# EasyEDA Pro project 1_J_LINK_PCB.epro

# Schematic Schematic1
Board Name: Board1; Create Date: 2025-04-07; Page Name: P1; Project Name: J Link; Schematic Name: Schematic1; Update Date: 2025-04-10; Company: 嘉立创EDA; Drawed: 李晓伟; Page Size: A4; Version: V1.0
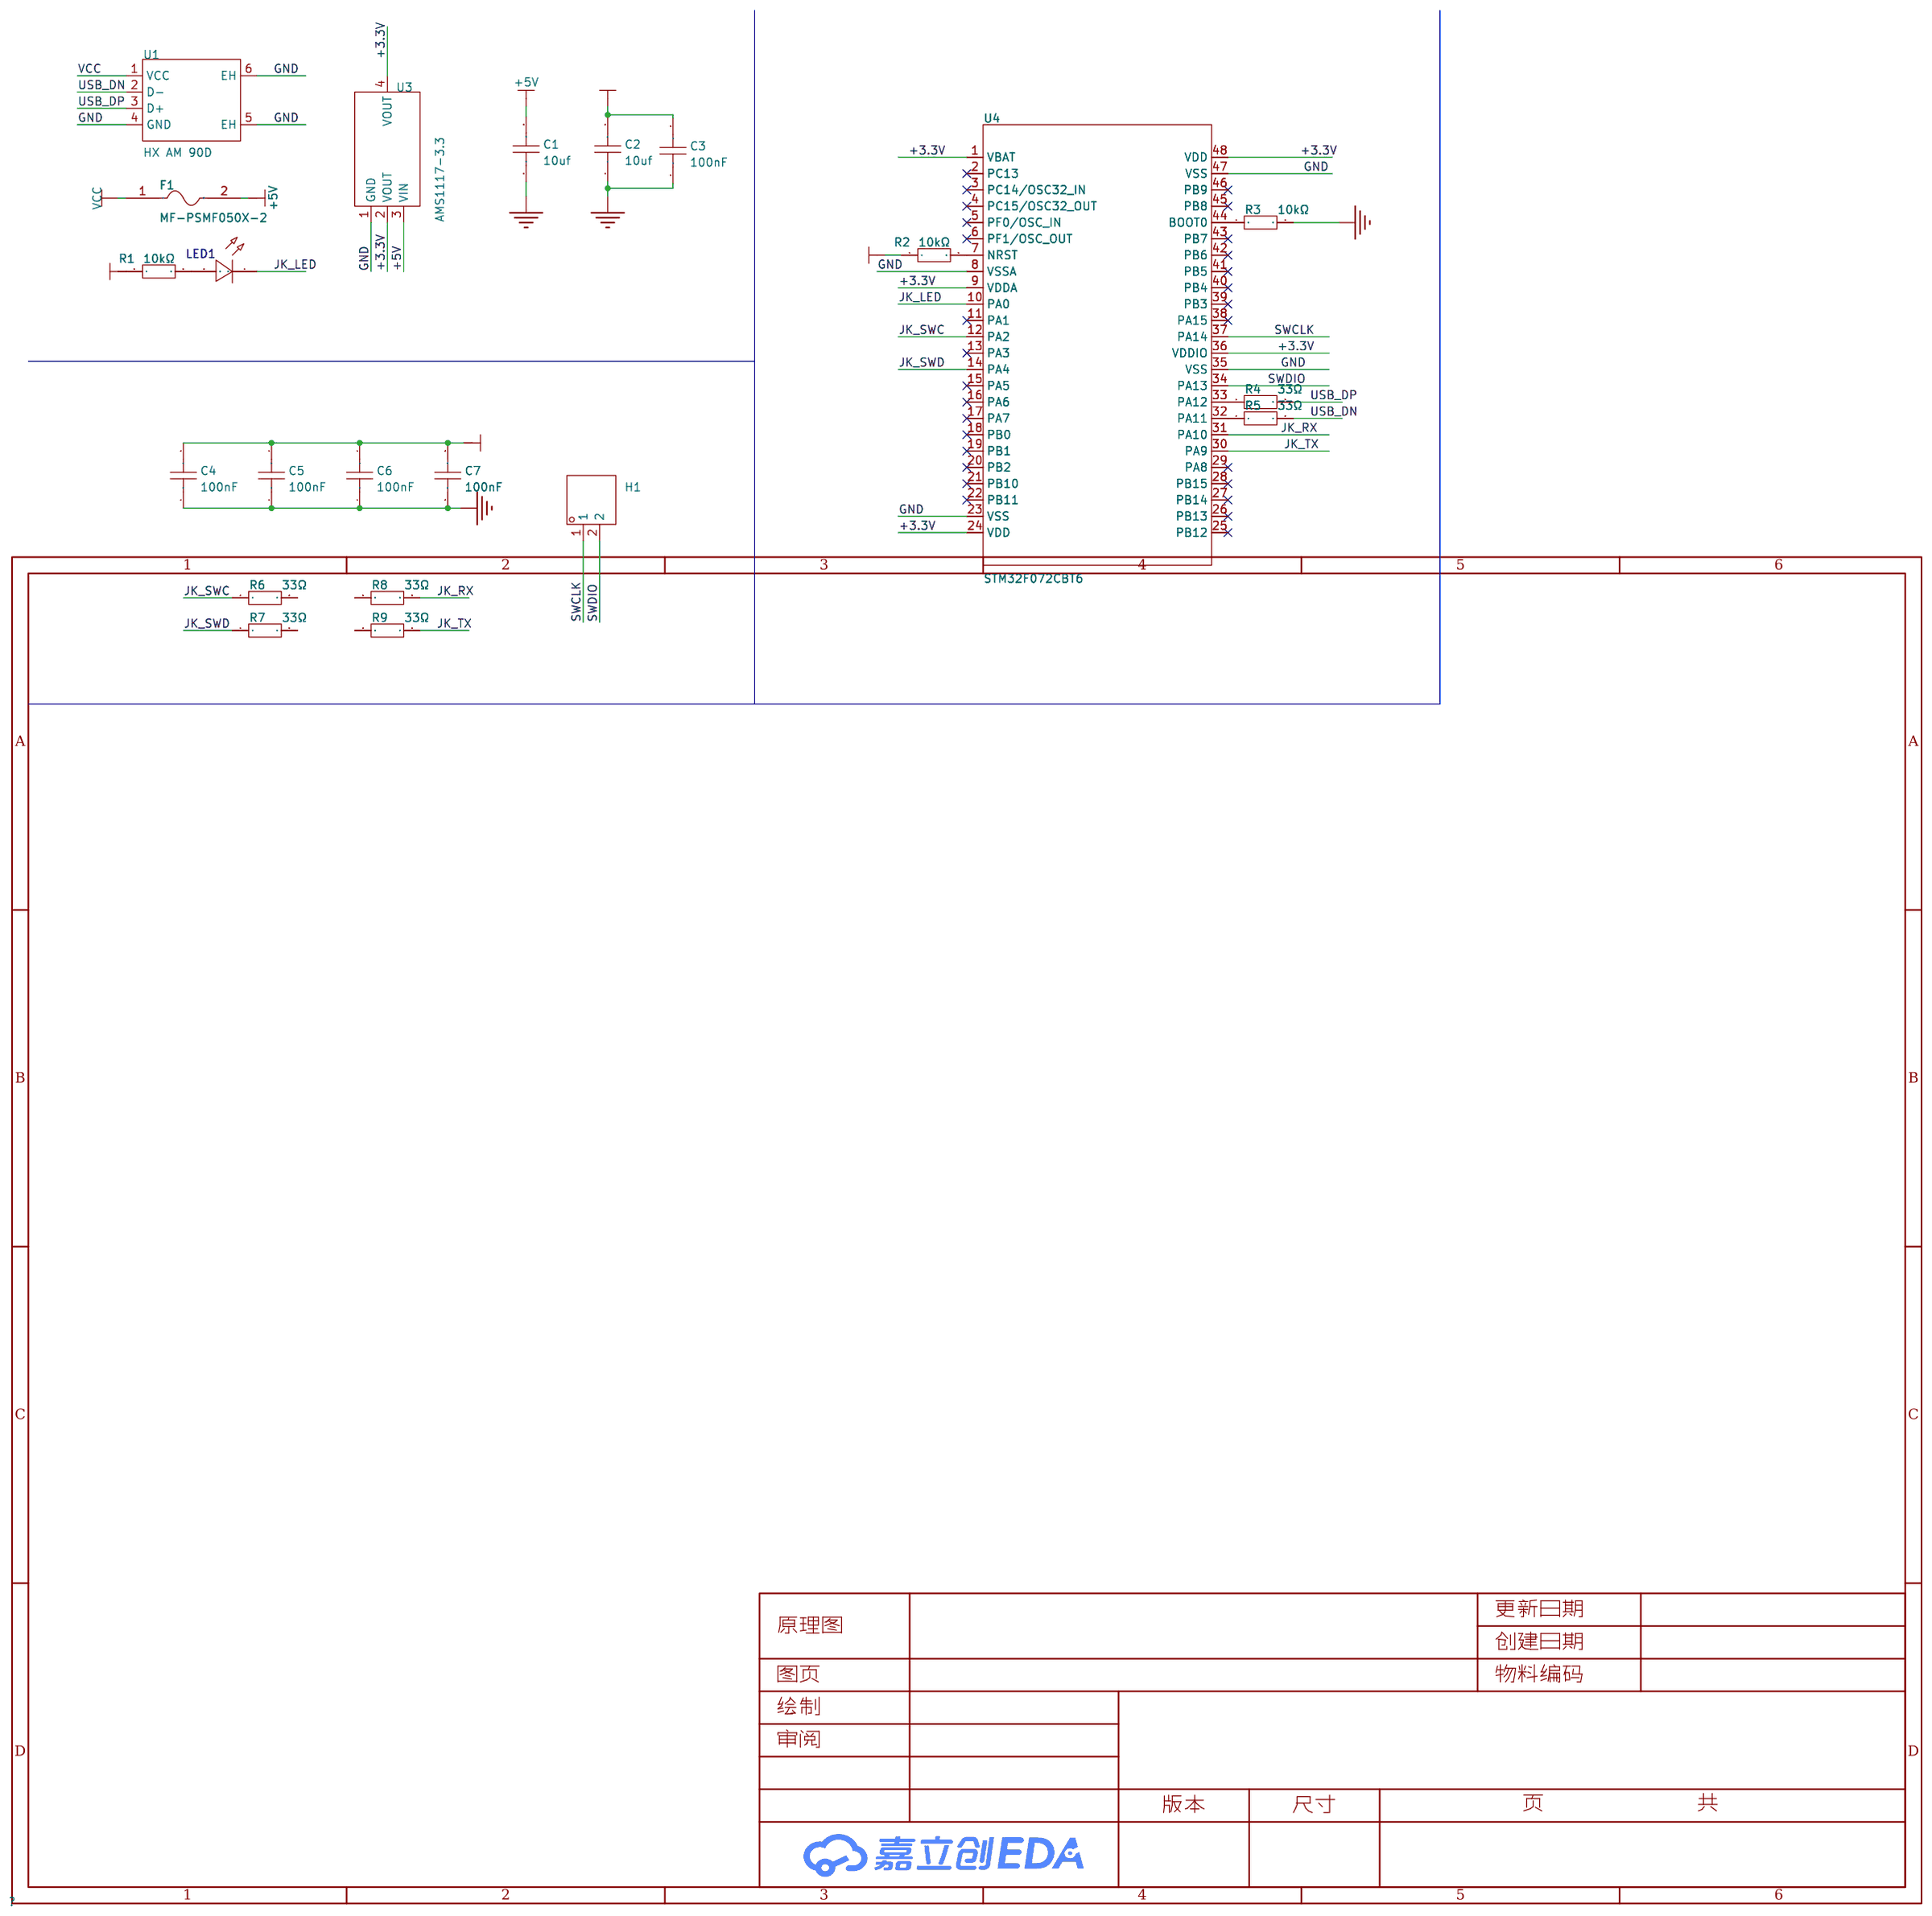
[diagram p0: schematic sheet]

## Parts
C1  10uf  [C0603]
C2  10uf  [C0603]
C3  100nF  [C0603]
C4  100nF  [C0603]
C5  100nF  [C0603]
C6  100nF  [C0603]
C7  100nF  [C0603]
F1  MF-PSMF050X-2  [F0805]
H1  -  [HDR-TH_2P-P2.54-V-M-1]
LED1  -  [LED_0603]
R1  10kΩ  [R0603]
R2  10kΩ  [R0603]
R3  10kΩ  [R0603]
R4  33Ω  [R0603]
R5  33Ω  [R0603]
R6  33Ω  [R0603]
R7  33Ω  [R0603]
R8  33Ω  [R0603]
R9  33Ω  [R0603]
U1  HX AM 90D  [USB-A-TH_HANXIA_HXAM90D]
U3  AMS1117-3.3  [SOT-223-3_L6.5-W3.4-P2.30-LS7.0-BR]
U4  STM32F072CBT6  [LQFP-48_L7.0-W7.0-P0.50-LS9.0-BL]

## Library data of the parts
C1-C3 = CAP_0603: Supplier Footprint: 0603
C4-C7 = CGA0603X7R104K500JT: 容值:100nF;精度:±10%;额定电压:50V;温度系数:X7R;; LCSC Part Name: 100nF ±10% 50V; Supplier Part: C6119867; Manufacturer: HRE(芯声); Supplier Footprint: 0603; JLCPCB Part Class: Extended Part; Datasheet: https://atta.szlcsc.com/upload/public/pdf/source/20250103/C44077DA9E7B3EFAE02F22B6D3D1CBC9.pdf; Supplier: LCSC; Tolerance: ±10%; Voltage Rating: 50V; Temperature Coefficient: X7R
F1 = MF-PSMF050X-2: 最大电压:6V;最大电流:40A;保持电流:500mA;跳闸电流:1A;; LCSC Part Name: 6V 500mA 0805自恢复; Supplier Part: C116170; Manufacturer: BOURNS; Supplier Footprint: 0805; JLCPCB Part Class: 扩展库; Datasheet: https://atta.szlcsc.com/upload/public/pdf/source/20170704/1499151353027.pdf; Supplier: LCSC; Operating Voltage (Max): 6V; Current Rating (Max): 40A; Hold Current: 500mA; Trip Current: 1A; Resistance - Initial (Ri) (Min): 150mΩ; Resistance - Post Trip (R1) (Max): 900mΩ; Maximum Time to Trip: 100ms; Operating Temperature: -40℃~+85℃
H1 = HDR-M_2.54_1x2P: Supplier Part: C124375; Supplier Footprint: 插件
LED1 = LED_0603-B: Supplier Footprint: 0603
R1-R9 = 0603WAF1002T5E: 电阻类型:厚膜电阻;阻值:10kΩ;精度:±1%;功率:100mW;最大工作电压:75V;温度系数:±100ppm/℃;; LCSC Part Name: 厚膜电阻 10kΩ ±1% 100mW; Supplier Part: C25804; Manufacturer: UNI-ROYAL(厚声); Supplier Footprint: 0603; JLCPCB Part Class: 基础库; Datasheet: https://atta.szlcsc.com/upload/public/pdf/source/20200306/C422600_1E6D84923E4A46A82E41ADD87F860B5C.pdf; Supplier: LCSC; Type: 厚膜电阻; Tolerance: ±1%; Power(Watts): 100mW; Overload Voltage (Max): 75V; Temperature Coefficient: ±100ppm/℃; Operating Temperature Range: -55℃~+155℃
U1 = HX AM 90D: 连接器类型:Type-A;标准:USB 2.0;公母:公;端口数量:1;触点数量:4P;额定电流 - 电源:1.5A;工作温度范围:-25℃~+85℃;; LCSC Part Name: Type-A 公; Supplier Part: C5160314; Manufacturer: hanxia(韩下); Supplier Footprint: 插件; JLCPCB Part Class: 扩展库; Datasheet: https://atta.szlcsc.com/upload/public/pdf/source/20220913/9B0C5C48054E49ABE499F2ADB77F3089.pdf; Supplier: LCSC; Connector Type: Type-A; Standard: USB 2.0; Gender: 公; Number of Ports: 1; Number of Contacts: 4P; Current Rating - Power (Max): 1.5A; Operating Temperature Range: -25℃~+85℃
U3 = AMS1117-3.3_C6186: 输出类型:固定;工作电压:-;输出电压:3.3V;输出电流:1A;电源纹波抑制比(PSRR):72dB@(120Hz);输出极性:正极;; LCSC Part Name: 输出3.3V 1A; Supplier Part: C6186; Manufacturer: AMS; Supplier Footprint: SOT-223; JLCPCB Part Class: 基础库; Datasheet: https://atta.szlcsc.com/upload/public/pdf/source/20180727/C6186_7A095716F0823C02F1997A905E26C086.pdf; Supplier: LCSC; Output Type: 固定; Output Voltage: 3.3V; Output Current: 1A; Power Supply Rejection Ratio (PSRR): 72dB@(120Hz); Voltage Dropout: 1.3V@(800mA); Features: 过流保护(OCP)；热关断(TSD); Output Configuration: 正极; Number of Outputs: 1
U4 = STM32F072CBT6: CPU内核:ARM-M0;CPU最大主频:48MHz;应用领域:-;; LCSC Part Name: 主流ARM Cortex-M0 USB系列MCU，具有128 KB Flash、48 MHz CPU、USB、CAN和CEC功能; Supplier Part: C81720; Manufacturer: ST(意法半导体); Supplier Footprint: LQFP-48(7x7); JLCPCB Part Class: Extended Part; Datasheet: https://atta.szlcsc.com/upload/public/pdf/source/20171102/C125825_15096092762561078351.pdf; Supplier: LCSC; CPU Core: ARM-M0; CPU Maximum Speed: 48MHz; Program Storage Size: 128KB; Program Memory Type: FLASH; Number of I/O: 37; ADC (Bit): 12bit; DAC (Bit): 12bit; Low Voltage Detection Threshold: 1.65V~3.6V

## Nets
+3.3V: C2.2 C3.2 C4.2 C5.2 C6.2 C7.2 R1.1 R2.1 U3.2(VOUT) U3.4(VOUT) U4.1(VBAT) U4.9(VDDA) U4.24(VDD) U4.36(VDDIO) U4.48(VDD)
+5V: C1.2 F1.2 U3.3(VIN)
GND: C1.1 C2.1 C3.1 C4.1 C5.1 C6.1 C7.1 R3.2 U1.4(GND) U1.5(EH) U1.6(EH) U3.1(GND) U4.8(VSSA) U4.23(VSS) U4.35(VSS) U4.47(VSS)
VCC: F1.1 U1.1(VCC)
JK_LED: LED1.1(C) U4.10(PA0)
JK_RX: R8.2 U4.31(PA10)
JK_SWC: R6.1 U4.12(PA2)
JK_SWD: R7.1 U4.14(PA4)
JK_TX: R9.2 U4.30(PA9)
SWCLK: H1.1 U4.37(PA14)
SWDIO: H1.2 U4.34(PA13)
USB_DN: R5.2 U1.2(D-)
USB_DP: R4.2 U1.3(D+)
$1N3007: R2.2 U4.7(NRST)
$1N3046: R3.1 U4.44(BOOT0)
$1N3085: R4.1 U4.33(PA12)
$1N3124: R5.1 U4.32(PA11)
$1N3328: LED1.2(A) R1.2

Not connected (* = marked no-connect by the designer): R6 2; R7 2; R8 1; R9 1; U4 2(PC13)* 3(PC14/OSC32_IN)* 4(PC15/OSC32_OUT)* 5(PF0/OSC_IN)* 6(PF1/OSC_OUT)* 11(PA1)* 13(PA3)* 15(PA5)* 16(PA6)* 17(PA7)* 18(PB0)* 19(PB1)* 20(PB2)* 21(PB10)* 22(PB11)* 25(PB12)* 26(PB13)* 27(PB14)* 28(PB15)* 29(PA8)* 38(PA15)* 39(PB3)* 40(PB4)* 41(PB5)* 42(PB6)* 43(PB7)* 45(PB8)* 46(PB9)*

# Board PCB1
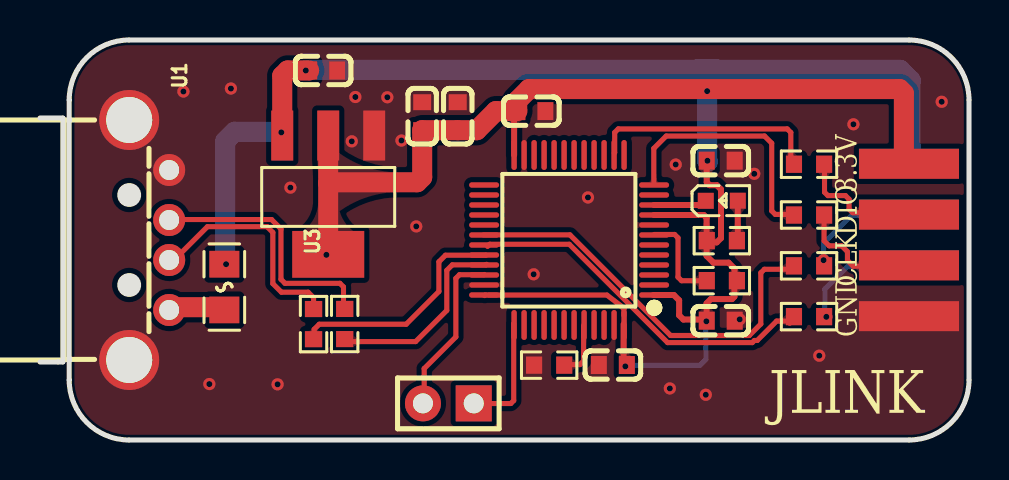
[diagram p1: board, top side]
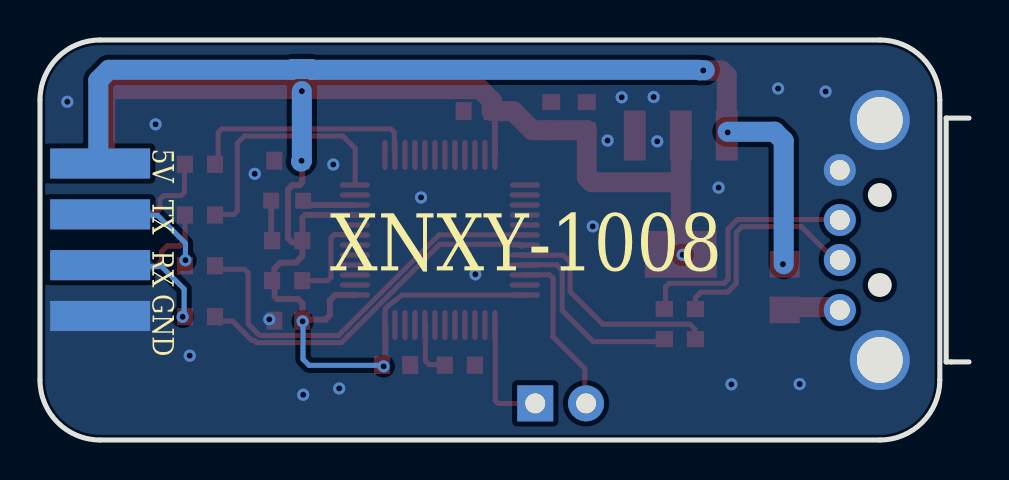
[diagram p2: board, bottom side, seen from below]

Outline 46.46 x 20 mm; copper layers: Top Layer, Bottom Layer. Coordinates in mm from the lower left corner of the outline.
Outline path: 1.46,17 1.46,3 arc(2.34,0.88) 4.46,0 43.46,0 arc(45.58,0.88) 46.46,3 46.46,17 arc(45.58,19.12) 43.46,20 4.46,20 arc(2.34,19.12) 1.46,17
Stack: Top Layer 0.035mm / Dielectric1 1.51mm FR4 er 4.5 / Bottom Layer 0.035mm

## Design rules (mm)
template: 自定义配置
spacing copperThickness1oz (default): track to track 0.102, other pairs 0.152 to 0.3
spacing copperThickness2oz: track to track 0.203, other pairs 0.152 to 0.3
track width copperThickness1oz (default): min 0.127, default 0.254, max 2.54
track width copperThickness2oz: min 0.203, default 0.254, max 2.54
differential pair differentialPair (default): width min 0.127, default 0.254, max 2.54; gap min 0.152, default 0.152
via viaSize (default): diameter min 0.5, default 0.61, max 10; hole min 0.3, default 0.305, max 6.3
net GND uses copperRegion1

## Placement (name value [footprint] x y rotation side)
C1  10uf  [C0603]  14.16 18.48 180 top
C2  10uf  [C0603]  19.11 16.19 270 top
C3  100nF  [C0603]  20.89 16.19 270 top
C4  100nF  [C0603]  34.04 5.97 180 top
C5  100nF  [C0603]  34.04 13.97 180 top
C6  100nF  [C0603]  28.65 3.75 0 top
C7  100nF  [C0603]  24.58 16.44 180 top
F1  MF-PSMF050X-2  [F0805]  9.22 7.65 90 top
H1  -  [HDR-TH_2P-P2.54-V-M-1]  20.42 1.83 180 top
LED1  -  [LED_0603]  34.15 11.97 0 top
NOREF  -  [Pad_e462]  43.45 13.82 0 top
NOREF#2  -  [Pad_e419]  43.46 8.73 0 top
NOREF#3  -  [Pad_e416]  43.46 13.81 0 top
NOREF#4  -  [Pad_e464]  43.45 8.74 0 top
NOREF#5  -  [Pad_e418]  43.46 11.27 0 top
NOREF#6  -  [Pad_e420]  43.46 6.19 0 top
NOREF#7  -  [Pad_e465]  43.45 6.2 0 top
NOREF#8  -  [Pad_e463]  43.45 11.28 0 top
R1  10kΩ  [R0603]  34.1 9.97 0 top
R2  10kΩ  [R0603]  34.1 7.97 180 top
R3  10kΩ  [R0603]  25.46 3.74 180 top
R4  33Ω  [R0603]  15.24 5.8 90 top
R5  33Ω  [R0603]  13.68 5.8 90 top
R6  33Ω  [R0603]  38.46 11.25 0 top
R7  33Ω  [R0603]  38.46 13.79 0 top
R8  33Ω  [R0603]  38.46 6.17 180 top
R9  33Ω  [R0603]  38.46 8.71 180 top
U1  HX AM 90D  [USB-A-TH_HANXIA_HXAM90D]  5.46 10 270 top
U3  AMS1117-3.3  [SOT-223-3_L6.5-W3.4-P2.30-LS7.0-BR]  14.42 12.25 90 top
U4  STM32F072CBT6  [LQFP-48_L7.0-W7.0-P0.50-LS9.0-BL]  26.46 10 90 top

## Footprints (pads in the part's own frame, mm; a bottom-side part is the same pattern mirrored in y, then rotated)
C0603
  rect 0.8x0.9 smd: 1(-0.7,0) 2(0.7,0)
F0805
  rect 1.335x1.5 smd: 1(-1.143,0) 2(1.143,0)
HDR-TH_2P-P2.54-V-M-1
  rect 1.8x1.8 hole 1: 1(-1.27,0)
  round 1.8 hole 1: 2(1.27,0)
LED_0603
  rect 0.8x0.8 smd: 1(-0.851,-0.01) 2(0.75,-0.005)
LQFP-48_L7.0-W7.0-P0.50-LS9.0-BL
  oval 0.27x1.5 smd: 1(-2.75,-4.25) 2(-2.25,-4.25) 3(-1.75,-4.25) 4(-1.25,-4.25) 5(-0.75,-4.25) 6(-0.25,-4.25) 7(0.25,-4.25) 8(0.75,-4.25) 9(1.25,-4.25) 10(1.75,-4.25) 11(2.25,-4.25) 12(2.75,-4.25) 25(2.75,4.25) 26(2.25,4.25) 27(1.75,4.25) 28(1.25,4.25) 29(0.75,4.25) 30(0.25,4.25) 31(-0.25,4.25) 32(-0.75,4.25) 33(-1.25,4.25) 34(-1.75,4.25) 35(-2.25,4.25) 36(-2.75,4.25)
  oval 1.5x0.27 smd: 13(4.25,-2.75) 14(4.25,-2.25) 15(4.25,-1.75) 16(4.25,-1.25) 17(4.25,-0.75) 18(4.25,-0.25) 19(4.25,0.25) 20(4.25,0.75) 21(4.25,1.25) 22(4.25,1.75) 23(4.25,2.25) 24(4.25,2.75) 37(-4.25,2.75) 38(-4.25,2.25) 39(-4.25,1.75) 40(-4.25,1.25) 41(-4.25,0.75) 42(-4.25,0.25) 43(-4.25,-0.25) 44(-4.25,-0.75) 45(-4.25,-1.25) 46(-4.25,-1.75) 47(-4.25,-2.25) 48(-4.25,-2.75)
Pad_e416
  rect 5x1.5 smd: 1(0,0)
Pad_e418
  rect 5x1.5 smd: 1(0,0)
Pad_e419
  rect 5x1.5 smd: 1(0,0)
Pad_e420
  rect 5x1.5 smd: 1(0,0)
Pad_e462
  rect 5x1.5 smd far side: 1(0,0)
Pad_e463
  rect 5x1.5 smd far side: 1(0,0)
Pad_e464
  rect 5x1.5 smd far side: 1(0,0)
Pad_e465
  rect 5x1.5 smd far side: 1(0,0)
R0603
  rect 0.806x0.864 smd: 1(-0.753,0) 2(0.753,0)
SOT-223-3_L6.5-W3.4-P2.30-LS7.0-BR
  rect 2.5x1.1 smd: 1(2.97,-2.3) 2(2.97,0) 3(2.97,2.3)
  rect 2.34x3.6 smd: 4(-2.97,0)
USB-A-TH_HANXIA_HXAM90D
  round 1.6 hole 1: 1(3.5,1) 2(1,1) 3(-1,1) 4(-3.5,1)
  round 3 hole 2.3: 5(-6,-1) 6(6,-1)

## Nets
As in the schematic, except:
+3.3V: C2.2 C3.2 C4.2 C5.2 C6.2 C7.2 NOREF#3.1 R1.1 R2.1 U3.2 U3.4 U4.1 U4.9 U4.24 U4.36 U4.48
+5V: C1.2 F1.2 NOREF.1 U3.3
GND: C1.1 C2.1 C3.1 C4.1 C5.1 C6.1 C7.1 NOREF#6.1 NOREF#7.1 R3.2 U1.4 U1.5 U1.6 U3.1 U4.8 U4.23 U4.35 U4.47

Pads without a net: NOREF#2 1; NOREF#4 1; NOREF#5 1; NOREF#8 1; R6 2; R7 2; R8 1; R9 1; U4 2 3 4 5 6 11 13 15 16 17 18 19 20 21 22 25 26 27 28 29 38 39 40 41 42 43 45 46

## Via types
v1: diameter 0.61, hole 0.305, Top Layer to Bottom Layer, 30 vias

## Routing (per net, layer and track width the routed paths; a pad name or vN(x,y) marks a point on that pad's centre or on a via; arc(x,y) is an arc through that point)
+3.3V: length 81.6
  Top Layer w0.254: 29.2,6.23 29.2,6.55 29.02,6.73 28.35,7.25 22.46,7.25 ; 22.24,7.22 22.28,7.26
  Top Layer w0.3: 33.43,9.88 33.85,9.88 34.06,10.09 34.06,12.53 33.85,12.74 33.49,12.74 33.34,12.89 C5.2 ; 33.43,9.88 33.34,9.79 33.34,9.2 33.68,8.87 34.44,8.87 34.74,8.57 34.74,8.09 R2.1 34.73,7.84 34.73,7.16 34.61,7.05 33.55,7.05 33.34,6.83 33.34,5.97 ; 33.43,9.88 R1.1 33.34,9.98 33.34,11.11 33.2,11.25 U4.9 ; 30.68,7.25 31.7,7.25 31.96,6.98 31.96,6.24 32.18,6.02 33.22,6.02 33.28,5.96 ; U4.24 23.71,16.09 23.81,16.19 ; 29.19,5.79 29.19,3.77
  Top Layer w1: 23.87,16.52 23.87,16.96 24.45,17.55 42.99,17.55 43.2,17.33 43.2,13.98 43.23,13.96 ; 14.42,12.84 U3.2 ; 14.42,12.84 U3.4 ; 14.42,12.84 14.46,12.89 18.86,12.89 19.11,13.14 C2.2 C3.2 21.84,15.49 22.8,16.44 C7.2
  Bottom Layer w0.254: 29.28,3.73 33,3.73 33.31,4.04 33.31,5.92 33.33,5.94
  Bottom Layer w1: 33.41,13.92 33.37,13.96 v1(33.37,17.44)
  vias: v1(14.32,9.26) v1(29.27,3.68) v1(33.38,13.96) v1(33.33,5.93)
+5V: length 48.4
  Top Layer w1: C1.2 12.38,18.48 12.12,18.21 U3.3
  Bottom Layer w1: 9.27,8.79 9.27,14.95 9.73,15.41 12.07,15.41 ; 43.54,13.73 43.54,17.98 43.02,18.51 33.86,18.51 33.82,18.55 32.91,18.55 32.87,18.51 13.52,18.51 13.5,18.49 13.22,18.49
  vias: v1(9.31,8.79) v1(12.07,15.38) v1(13.29,18.48)
GND:
  vias: v1(7.17,17.42) v1(8.47,2.8) v1(9.55,17.57) v1(11.88,2.78) v1(12.52,12.62) v1(15.59,14.93) v1(15.77,17.15) v1(17.37,17.14) v1(18.08,14.97) v1(18.82,10.68) v1(24.69,8.28) v1(27.41,12.13) v1(31.5,2.58) v1(31.79,13.77) v1(33.3,2.26) v1(34.99,6.03) v1(35.72,13.31) v1(38.97,4.22) v1(40.68,15.78) v1(45.09,16.91)
VCC: length 2.9
  Top Layer w1: 6.38,6.64 9.16,6.64 9.22,6.58
(no net): length 24.7
  Top Layer w0.254: 39.26,13.79 39.24,13.77 39.24,12.39 39.4,12.22 40.28,12.22 40.46,12.04 40.46,11.55 40.64,11.37 44.04,11.37 44.08,11.33 44.1,11.33 ; 42.96,8.69 40.67,8.69 40.38,8.98 40.38,9.42 40.09,9.71 39.47,9.71 39.21,9.96 39.21,11.32
  Bottom Layer w0.254: v1(39.19,8.99) 39.19,9.84 40.57,11.23 43.44,11.23 ; 43.54,8.67 40.38,8.67 39.25,7.55 39.25,6.33 39.38,6.2
  vias: v1(39.33,6.16)
JK_LED: length 2.7
  Top Layer w0.3: LED1.1 33.09,11.75 U4.10
JK_RX: length 17.7
  Top Layer w0.254: 37.5,5.84 37.39,5.95 36.84,5.95 35.87,4.98 35.73,4.98 35.62,4.87 31.39,4.87 26.47,9.79 22.49,9.79 22.39,9.68
JK_SWC: length 12.4
  Top Layer w0.254: 30.7,12.79 30.7,14.58 31.32,15.2 36.23,15.2 36.59,14.84 36.59,11.46 36.77,11.28 37.5,11.28
JK_SWD: length 11.4
  Top Layer w0.254: 37.68,14.04 37.55,14.17 37.55,15.38 37.37,15.55 28.92,15.55 28.74,15.38 28.74,14.37 28.72,14.36
JK_TX: length 20.4
  Top Layer w0.254: 37.65,8.55 37.63,8.54 36.23,8.54 36.05,8.36 36.05,5.8 35.47,5.22 31.54,5.22 26.51,10.26 22.19,10.26
SWCLK: length 5.9
  Top Layer w0.254: 23.69,5.83 23.69,1.97 23.55,1.82 21.69,1.82 21.68,1.81
SWDIO: length 8.4
  Top Layer w0.254: 22.22,8.28 22.21,8.26 20.98,8.26 20.8,8.08 20.8,5.16 19.21,3.57 19.21,2.01 19.11,1.9
USB_DN: length 11.4
  Top Layer w0.254: 6.62,9.06 6.77,9.06 8.37,10.67 11.36,10.67 11.64,10.38 11.64,7.82 12.07,7.39 13.41,7.39 13.68,7.12 13.68,6.45 13.65,6.42
USB_DP: length 12.5
  Top Layer w0.254: 15.28,6.52 15.18,6.62 15.18,7.65 15,7.83 12.25,7.83 12.05,8.03 12.05,10.55 11.58,11.02 6.68,11.02
$1N3007: length 4.6
  Top Layer w0.254: 33.25,7.96 33.24,7.96 32.09,7.96 31.91,8.14 31.91,10.11 31.74,10.28 30.72,10.28
$1N3046: length 2.7
  Top Layer w0.254: 27.19,5.73 27.19,3.96 27,3.77 26.34,3.77
$1N3085: length 9.9
  Top Layer w0.254: 22.33,8.78 22.31,8.76 20.62,8.76 20.34,8.48 20.34,6.48 18.79,4.92 15.24,4.92 15.19,4.97
$1N3124: length 11.5
  Top Layer w0.254: 22.3,9.24 22.3,9.24 20.28,9.24 19.95,8.91 19.95,7.42 18.31,5.79 13.97,5.79 13.71,5.53 13.71,5.09 13.74,5.06
$1N3328: length 2
  Top Layer w0.3: R1.2 34.9,10.01 LED1.2

## Copper pours and planes (outline as drawn; the poured copper is in the pictures)
GND on Top Layer: -4.25,24.53 51.1,24.53 51.1,-5.22 -4.25,-5.22
GND on Bottom Layer: -0.85,23.67 50.77,23.67 50.77,-3.07 -0.85,-3.07

Small or netless copper shapes (teardrops, artwork), in the pictures only: 35 on Top Layer, 5 on Bottom Layer

## Text on the board
Bottom Silkscreen Layer: 5V | GND | TX | RX | XNXY-1008
Top Silkscreen Layer: 3.3V | DIO | CLK | GND | JLINK
